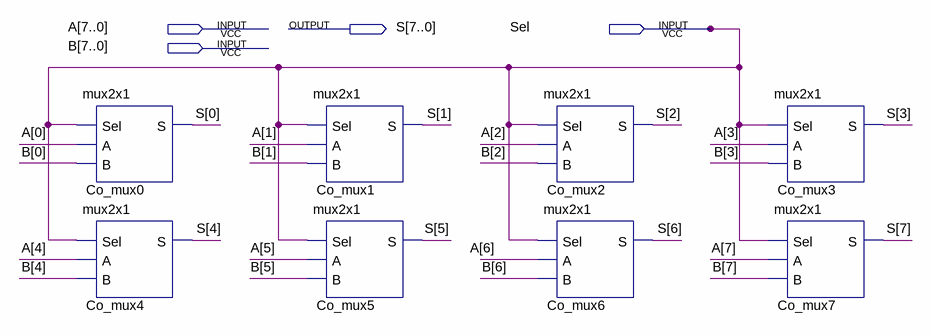
[diagram p0: schematic sheet]
// Quartus schematic mux2x1-8io.bdf as structural Verilog: 8 symbols, 4 pins
module \mux2x1-8io  (
  input  [7:0] A,
  input  Sel,
  input  [7:0] B,
  output [7:0] S
);

  mux2x1 Co_mux0 (.Sel(Sel), .A(A[0]), .B(B[0]), .S(S[0]));
  mux2x1 Co_mux4 (.Sel(Sel), .A(A[4]), .B(B[4]), .S(S[4]));
  mux2x1 Co_mux1 (.Sel(Sel), .A(A[1]), .B(B[1]), .S(S[1]));
  mux2x1 Co_mux5 (.Sel(Sel), .A(A[5]), .B(B[5]), .S(S[5]));
  mux2x1 Co_mux2 (.Sel(Sel), .A(A[2]), .B(B[2]), .S(S[2]));
  mux2x1 Co_mux6 (.Sel(Sel), .A(A[6]), .B(B[6]), .S(S[6]));
  mux2x1 Co_mux3 (.Sel(Sel), .A(A[3]), .B(B[3]), .S(S[3]));
  mux2x1 Co_mux7 (.Sel(Sel), .A(A[7]), .B(B[7]), .S(S[7]));
endmodule
